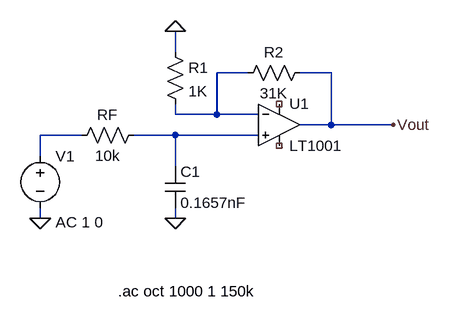
[diagram p0: schematic Draft4.asc]
Draft4.asc, the LTspice schematic file:
Version 4
SHEET 1 880 680
WIRE 384 208 384 176
WIRE 496 240 448 240
WIRE 624 240 576 240
WIRE 384 304 384 288
WIRE 448 304 448 240
WIRE 448 304 384 304
WIRE 512 304 448 304
WIRE 624 320 624 240
WIRE 624 320 576 320
WIRE 720 320 624 320
WIRE 240 336 176 336
WIRE 384 336 320 336
WIRE 512 336 384 336
WIRE 176 368 176 336
WIRE 384 384 384 336
WIRE 176 464 176 448
WIRE 384 464 384 448
FLAG 720 320 Vout
FLAG 384 464 0
FLAG 176 464 0
FLAG 384 176 0
SYMBOL Voltage 176 352 R0
WINDOW 3 24 96 Invisible 2
WINDOW 123 24 118 Left 2
SYMATTR Value ""
SYMATTR Value2 AC 1 0
SYMATTR InstName V1
SYMBOL Cap 368 384 R0
SYMATTR InstName C1
SYMATTR Value 0.1657nF
SYMBOL Res 336 320 R90
WINDOW 0 0 56 VBottom 2
WINDOW 3 32 56 VTop 2
SYMATTR InstName RF
SYMATTR Value 10k
SYMBOL OpAmps/LT1001 544 256 R0
SYMATTR InstName U1
SYMBOL Res 592 224 R90
WINDOW 0 0 56 VBottom 2
WINDOW 3 32 56 VTop 2
SYMATTR InstName R2
SYMATTR Value 31K
SYMBOL Res 368 192 R0
SYMATTR InstName R1
SYMATTR Value 1K
TEXT 296 576 Left 2 !.ac oct 1000 1 150k

The netlist it stands for:
* Draft4.asc
V1 N002 0 AC 1 0
C1 N003 0 0.1657nF
RF N003 N002 10k
XU1 N003 N001 NC_01 NC_02 Vout LT1001  ; pins In+ In- V+ V- OUT
R2 Vout N001 31K
R1 0 N001 1K
.ac oct 1000 1 150k
.lib LTC.lib
.backanno
.end